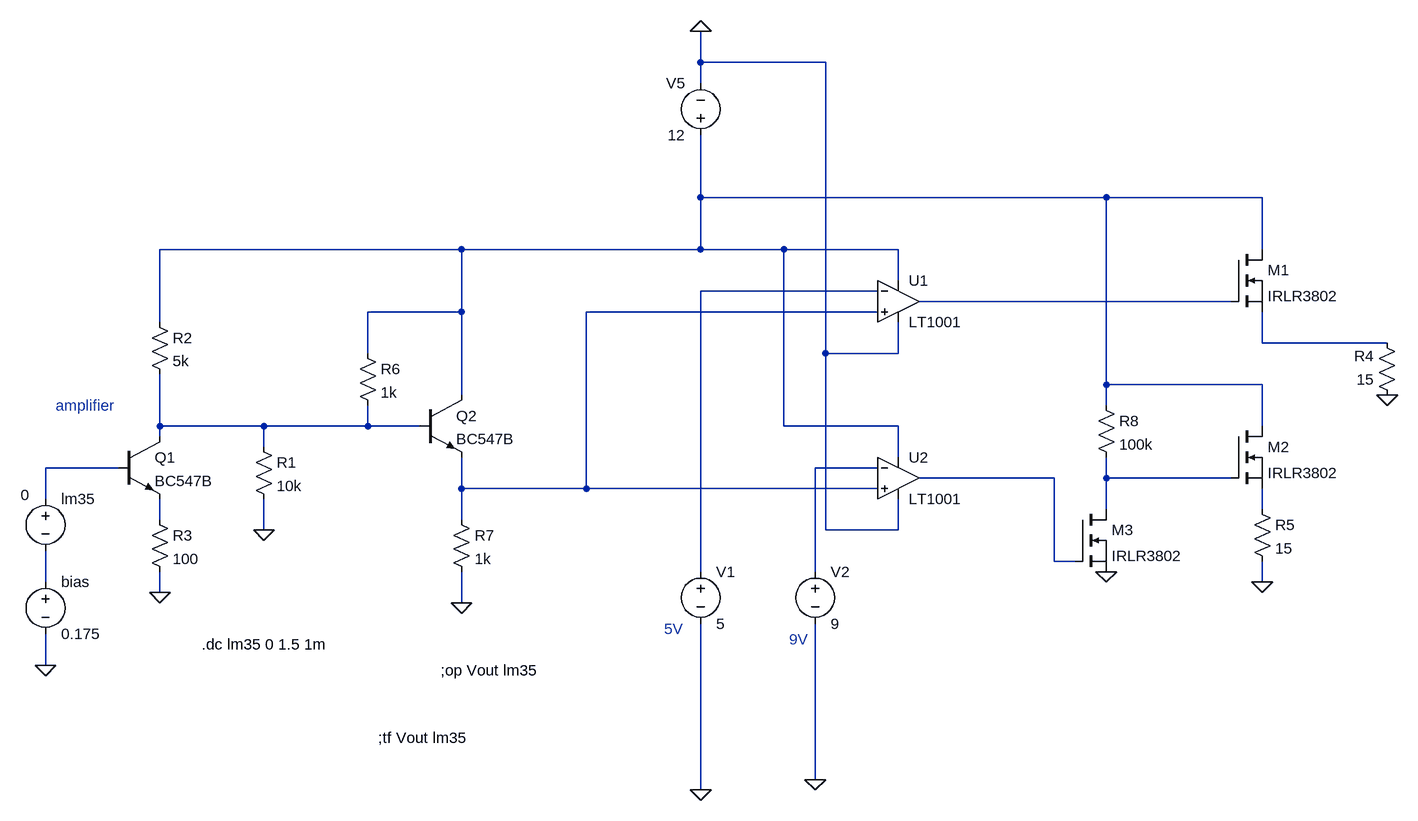
[diagram p0: schematic IE_final_design.asc]
IE_final_design.asc, the LTspice schematic file:
Version 4
SHEET 1 2676 680
WIRE 624 -464 624 -512
WIRE 816 -464 624 -464
WIRE 624 -432 624 -464
WIRE 624 -256 624 -352
WIRE 1248 -256 624 -256
WIRE 1488 -256 1248 -256
WIRE 256 -176 -208 -176
WIRE 624 -176 624 -256
WIRE 624 -176 256 -176
WIRE 752 -176 624 -176
WIRE 928 -176 752 -176
WIRE 1488 -176 1488 -256
WIRE 928 -128 928 -176
WIRE 896 -112 624 -112
WIRE 1440 -96 960 -96
WIRE 256 -80 256 -176
WIRE 256 -80 112 -80
WIRE 896 -80 448 -80
WIRE -208 -64 -208 -176
WIRE 1488 -32 1488 -80
WIRE 1680 -32 1488 -32
WIRE 112 -16 112 -80
WIRE 816 -16 816 -464
WIRE 928 -16 928 -64
WIRE 928 -16 816 -16
WIRE 1248 32 1248 -256
WIRE 1488 32 1248 32
WIRE 256 48 256 -80
WIRE 1248 64 1248 32
WIRE -208 96 -208 16
WIRE -48 96 -208 96
WIRE 112 96 112 64
WIRE 112 96 -48 96
WIRE 192 96 112 96
WIRE 752 96 752 -176
WIRE 928 96 752 96
WIRE 1488 96 1488 32
WIRE -208 112 -208 96
WIRE -48 128 -48 96
WIRE 928 144 928 96
WIRE -272 160 -384 160
WIRE 896 160 800 160
WIRE 1168 176 960 176
WIRE 1248 176 1248 144
WIRE 1440 176 1248 176
WIRE 256 192 256 144
WIRE 448 192 448 -80
WIRE 448 192 256 192
WIRE 896 192 448 192
WIRE -384 208 -384 160
WIRE 1248 224 1248 176
WIRE 1488 224 1488 192
WIRE -208 240 -208 208
WIRE 256 240 256 192
WIRE -48 256 -48 208
WIRE 816 256 816 -16
WIRE 928 256 928 208
WIRE 928 256 816 256
WIRE 1168 304 1168 176
WIRE 1200 304 1168 304
WIRE 624 320 624 -112
WIRE 800 320 800 160
WIRE -384 336 -384 288
WIRE 1488 336 1488 304
WIRE -208 352 -208 320
WIRE 256 368 256 320
WIRE -384 464 -384 416
WIRE 800 640 800 400
WIRE 624 656 624 400
FLAG -48 256 0
FLAG -384 464 0
FLAG -208 352 0
FLAG 624 -512 0
FLAG 256 368 0
FLAG 1488 336 0
FLAG 1680 48 0
FLAG 1248 320 0
FLAG 624 656 0
FLAG 800 640 0
SYMBOL voltage -384 192 R0
WINDOW 3 -38 10 Left 2
WINDOW 123 0 0 Left 0
WINDOW 39 0 0 Left 0
SYMATTR Value 0
SYMATTR InstName lm35
SYMBOL voltage -384 320 R0
WINDOW 123 0 0 Left 0
WINDOW 39 0 0 Left 0
SYMATTR InstName bias
SYMATTR Value 0.175
SYMBOL npn -272 112 R0
SYMATTR InstName Q1
SYMATTR Value BC547B
SYMBOL res -224 -80 R0
SYMATTR InstName R2
SYMATTR Value 5k
SYMBOL res -224 224 R0
SYMATTR InstName R3
SYMATTR Value 100
SYMBOL res -64 112 R0
SYMATTR InstName R1
SYMATTR Value 10k
SYMBOL OpAmps\\LT1001 928 -160 R0
SYMATTR InstName U1
SYMBOL OpAmps\\LT1001 928 112 R0
SYMATTR InstName U2
SYMBOL voltage 624 -336 R180
WINDOW 0 24 96 Left 2
WINDOW 3 24 16 Left 2
WINDOW 123 0 0 Left 0
WINDOW 39 0 0 Left 0
SYMATTR InstName V5
SYMATTR Value 12
SYMBOL npn 192 48 R0
SYMATTR InstName Q2
SYMATTR Value BC547B
SYMBOL res 96 -32 R0
SYMATTR InstName R6
SYMATTR Value 1k
SYMBOL res 240 224 R0
SYMATTR InstName R7
SYMATTR Value 1k
SYMBOL nmos 1440 -176 R0
SYMATTR InstName M1
SYMATTR Value IRLR3802
SYMBOL nmos 1440 96 R0
SYMATTR InstName M2
SYMATTR Value IRLR3802
SYMBOL res 1696 64 R180
WINDOW 0 36 76 Left 2
WINDOW 3 36 40 Left 2
SYMATTR InstName R4
SYMATTR Value 15
SYMBOL res 1472 208 R0
SYMATTR InstName R5
SYMATTR Value 15
SYMBOL res 1232 48 R0
SYMATTR InstName R8
SYMATTR Value 100k
SYMBOL nmos 1200 224 R0
SYMATTR InstName M3
SYMATTR Value IRLR3802
SYMBOL voltage 624 304 R0
WINDOW 123 0 0 Left 0
WINDOW 39 0 0 Left 0
SYMATTR InstName V1
SYMATTR Value 5
SYMBOL voltage 800 304 R0
WINDOW 123 0 0 Left 0
WINDOW 39 0 0 Left 0
SYMATTR InstName V2
SYMATTR Value 9
TEXT -144 432 Left 2 !.dc lm35 0 1.5 1m
TEXT -368 64 Left 2 ;amplifier
TEXT 760 424 Left 2 ;9V
TEXT 568 408 Left 2 ;5V
TEXT 128 576 Left 2 !;tf Vout lm35
TEXT 224 472 Left 2 !;op Vout lm35

The netlist it stands for:
* IE_final_design.asc
V§lm35 N007 N013 0
V§bias N013 0 0.175
Q1 N006 N007 N012 0 BC547B
R2 N001 N006 5k
R3 N012 0 100
R1 N006 0 10k
XU1 N004 N002 N001 0 N003 LT1001  ; pins In+ In- V+ V- OUT
XU2 N004 N008 N001 0 N009 LT1001  ; pins In+ In- V+ V- OUT
V5 N001 0 12
Q2 N001 N006 N004 0 BC547B
R6 N001 N006 1k
R7 N004 0 1k
M1 N001 N003 N005 N005 IRLR3802
M2 N001 N010 N011 N011 IRLR3802
R4 0 N005 15
R5 N011 0 15
R8 N001 N010 100k
M3 N010 N009 0 0 IRLR3802
V1 N002 0 5
V2 N008 0 9
.model NPN NPN
.model PNP PNP
.lib standard.bjt
.model NMOS NMOS
.model PMOS PMOS
.lib standard.mos
.dc lm35 0 1.5 1m
* amplifier
* 9V
* 5V
;tf Vout lm35
;op Vout lm35
.lib LTC.lib
.backanno
.end